# Altium project Aux_Lights_Daughter_REV3.PrjPcb
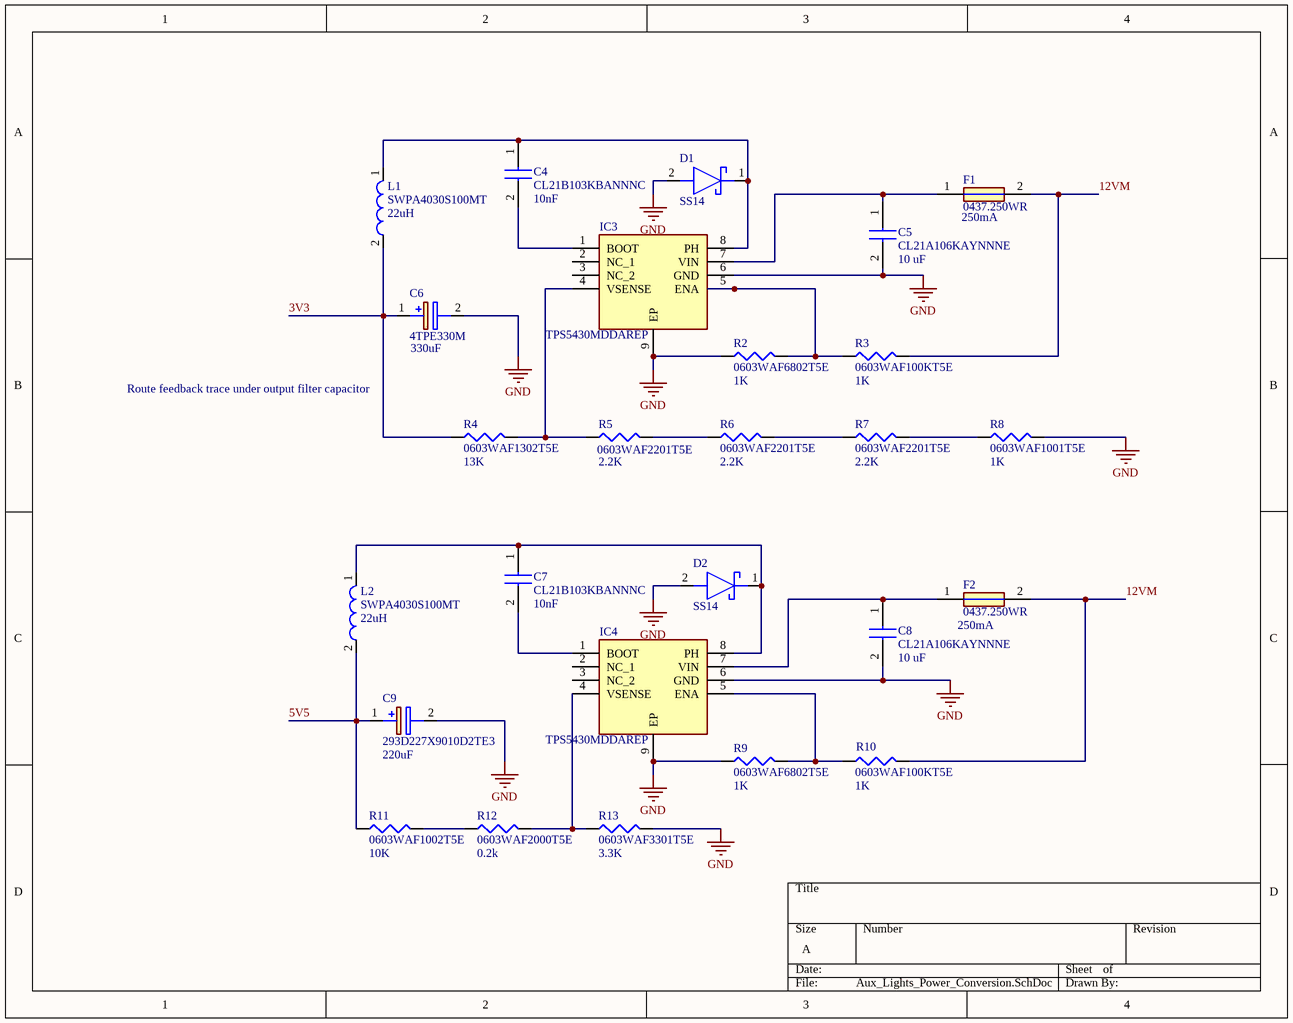
[diagram p0: Aux_Lights_Power_Conversion.SchDoc]
2 sheets, 49 parts. Net scope: global (net labels, ports and power ports of the same name join across sheets).
Board file: Aux_Lights_Daughter_REV3.PcbDoc
Sheets:
  Aux_Lights_Power_Conversion.SchDoc
  Aux_Lights_Daughter_REV3.SchDoc

## Sheet Aux_Lights_Power_Conversion.SchDoc
size A; SheetNumber: 1; SheetTotal: 2

### Parts
C4  CL21B103KBANNNC  value 10nF  [CAPC2012X65N]
C5  CL21A106KAYNNNE  value 10 uF  [CAPC2012X145N]
C6  4TPE330M  value 330uF  [POSCAP_D12_D15_D15E_D2E_D2_D3L_D4]
C7  CL21B103KBANNNC  value 10nF  [CAPC2012X65N]
C8  CL21A106KAYNNNE  value 10 uF  [CAPC2012X145N]
C9  293D227X9010D2TE3  value 220uF  [CAPPM7343X310N]
D1  SS14  [DIONM5327X242N]
D2  SS14  [DIONM5327X242N]
F1  0437.250WR  value 250mA  [FUSC3216X86N]
F2  0437.250WR  value 250mA  [FUSC3216X86N]
IC3  TPS5430MDDAREP  [SOIC127P600X170-9N]
IC4  TPS5430MDDAREP  [SOIC127P600X170-9N]
L1  SWPA4030S100MT  value 22uH  [SWPA4030S100MT]
L2  SWPA4030S100MT  value 22uH  [SWPA4030S100MT]
R2  0603WAF6802T5E  value 1K  [J1-0603]
R3  0603WAF100KT5E  value 1K  [J1-0603]
R4  0603WAF1302T5E  value 13K  [J1-0603]
R5  0603WAF2201T5E  value 2.2K  [J1-0603]
R6  0603WAF2201T5E  value 2.2K  [J1-0603]
R7  0603WAF2201T5E  value 2.2K  [J1-0603]
R8  0603WAF1001T5E  value 1K  [J1-0603]
R9  0603WAF6802T5E  value 1K  [J1-0603]
R10  0603WAF100KT5E  value 1K  [J1-0603]
R11  0603WAF1002T5E  value 10K  [J1-0603]
R12  0603WAF2000T5E  value 0.2k  [J1-0603]
R13  0603WAF3301T5E  value 3.3K  [J1-0603]

### Nets
GND: C5.2 C6.2(-) C8.2 C9.2(-) D1.2(A) D2.2(A) IC3.6(GND) IC3.9(EP) IC4.6(GND) IC4.9(EP) R2.1 R8.2 R9.1 R13.2
3V3: C6.1(+) L1.2 R4.1
5V5: C9.1(+) L2.2 R11.1
12VM: F1.2 F2.2 R3.2 R10.2
NetC4_1: C4.1 D1.1(K) IC3.8(PH) L1.1
NetC4_2: C4.2 IC3.1(BOOT)
NetC5_1: C5.1 F1.1 IC3.7(VIN)
NetC7_1: C7.1 D2.1(K) IC4.8(PH) L2.1
NetC7_2: C7.2 IC4.1(BOOT)
NetC8_1: C8.1 F2.1 IC4.7(VIN)
NetIC3_4: IC3.4(VSENSE) R4.2 R5.1
NetIC3_5: IC3.5(ENA) R2.2 R3.1
NetIC4_4: IC4.4(VSENSE) R12.2 R13.1
NetIC4_5: IC4.5(ENA) R9.2 R10.1
NetR5_2: R5.2 R6.1
NetR6_2: R6.2 R7.1
NetR7_2: R7.2 R8.1
NetR11_2: R11.2 R12.1

Not connected (* = marked no-connect by the designer): IC3 2(NC_1) 3(NC_2); IC4 2(NC_1) 3(NC_2)

### Notes on the sheet
- Route feedback trace under output filter capacitor

### Library data of the parts
C4 C7 = CL21B103KBANNNC: Capacitor; Manufacturer_Name: Samsung Electro-Mechanics; Datasheet Link: https://datasheet.datasheetarchive.com/originals/distributors/Datasheets_SAMA/97c54fb7f716f6f5bd35dfc2c9b17795.pdf; Height: 0.65mm; Manufacturer_Part_Number: CL21B103KBANNNC
C5 C8 = CL21A106KAYNNNE: Capacitor; Manufacturer_Name: Samsung Electro-Mechanics; Datasheet Link: https://datasheet.datasheetarchive.com/originals/distributors/Datasheets_SAMA/6a45835c9b7400e9b49c55c38a8ff4a2.pdf; Height: 1.45mm; Manufacturer_Part_Number: CL21A106KAYNNNE
C6 = 4TPE330M: Capacitor Polarised; Manufacturer_Name: Panasonic; Datasheet Link: http://industrial.panasonic.com/cdbs/www-data/pdf/AAA8000/AAA8000C36.pdf; Manufacturer_Part_Number: 4TPE330M
C9 = 293D227X9010D2TE3: Capacitor Polarised; Manufacturer_Name: Vishay; Datasheet Link: http://www.vishay.com/doc?40002; Height: 3.1mm; Manufacturer_Part_Number: 293D227X9010D2TE3
D1 D2 = SS14: Schottky Diode; Manufacturer_Name: MDD(Microdiode Electronics); Datasheet Link: https://datasheet.lcsc.com/szlcsc/1903051003_MDD-Jiangsu-Yutai-Elec-SS14_C2480.pdf; Height: 2.42mm; Manufacturer_Part_Number: SS14
F1 F2 = 0437.250WR: Fuse; Manufacturer_Name: LITTELFUSE; Datasheet Link: https://m.littelfuse.com/~/media/electronics/datasheets/fuses/littelfuse_fuse_437_datasheet.pdf.pdf; Height: 0.864mm; Manufacturer_Part_Number: 0437.250WR
IC3 IC4 = TPS5430MDDAREP: Integrated Circuit; Manufacturer_Name: Texas Instruments; Datasheet Link: http://www.ti.com/lit/gpn/tps5430-ep; Height: 1.7mm; Mouser2 Part Number: 595-TPS5430MDDAREP; Mouser2 Price/Stock: https://www.mouser.com/Search/Refine.aspx?Keyword=595-TPS5430MDDAREP; Manufacturer_Part_Number: TPS5430MDDAREP
R2-R13 = Res3: Resistor; Published: 8-Jun-2000; LatestRevisionDate: 29-May-2009; LatestRevisionNote: IPC-7351 Footprint Added.; PackageReference: J1-0603; Publisher: Altium Limited; PackageDescription: Chip Resistor

## Sheet Aux_Lights_Daughter_REV3.SchDoc
size A; SheetNumber: 2; SheetTotal: 2
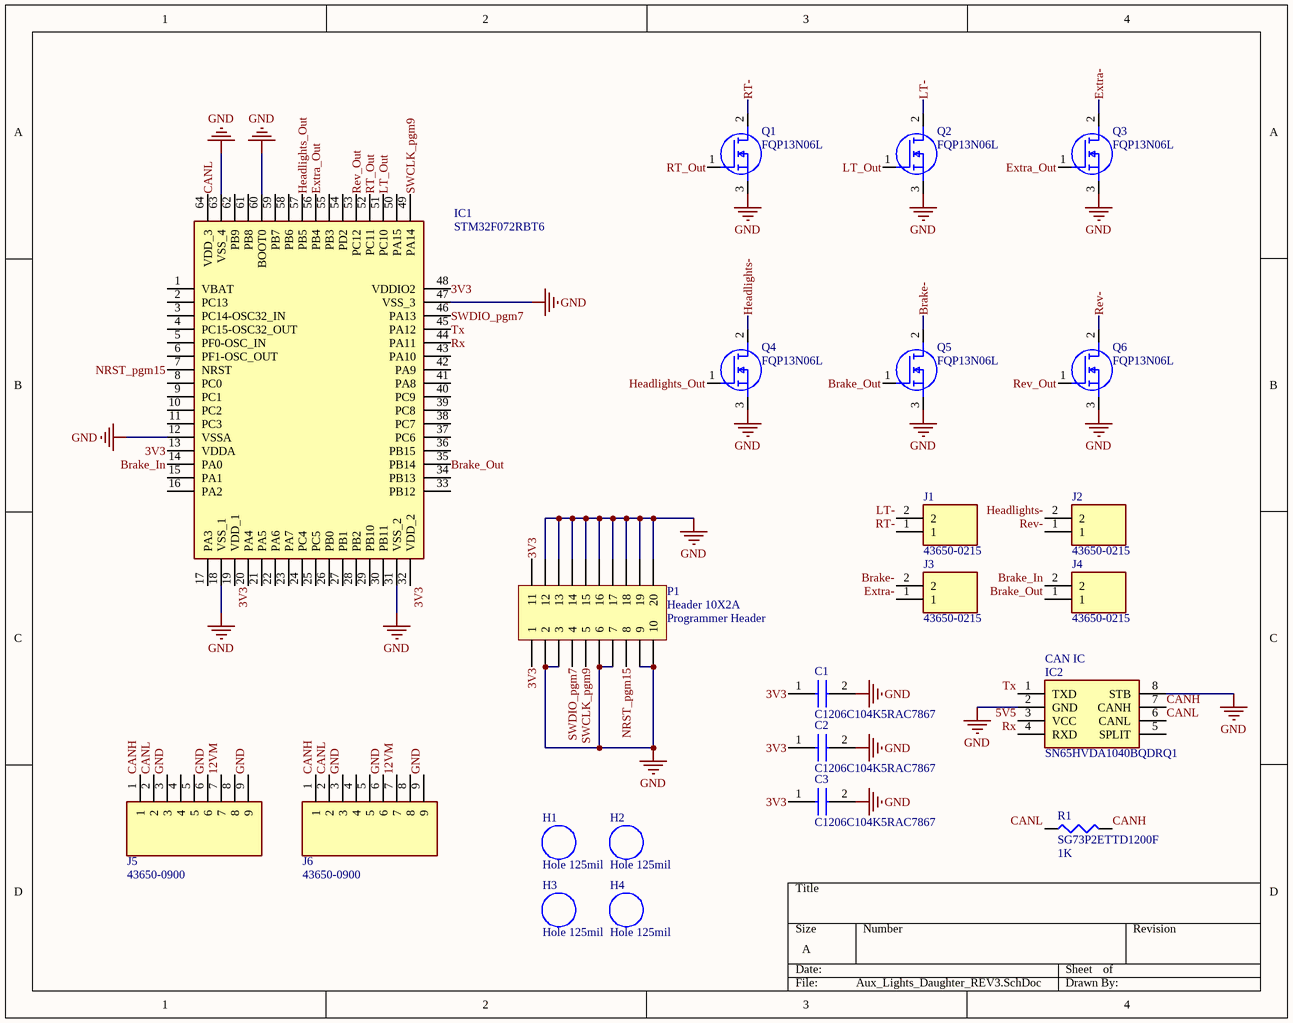
[diagram p1: Aux_Lights_Daughter_REV3.SchDoc]

### Parts
C1  C1206C104K5RAC7867  [CAPC3216X110N]
C2  C1206C104K5RAC7867  [CAPC3216X110N]
C3  C1206C104K5RAC7867  [CAPC3216X110N]
H1  Hole 125mil  [Hole]
H2  Hole 125mil  [Hole]
H3  Hole 125mil  [Hole]
H4  Hole 125mil  [Hole]
IC1  STM32F072RBT6  [QFP50P1200X1200X160-64N]
IC2  SN65HVDA1040BQDRQ1  [SOIC127P600X175-8N]
J1  43650-0215  [43650-02YY_15,16,17]
J2  43650-0215  [43650-02YY_15,16,17]
J3  43650-0215  [43650-02YY_15,16,17]
J4  43650-0215  [43650-02YY_15,16,17]
J5  43650-0900  [43650-09YY_R]
J6  43650-0900  [43650-09YY_R]
P1  Header 10X2A  [HDR2X10_CEN]
Q1  FQP13N06L  [TO254P483X1016X2261-3P]
Q2  FQP13N06L  [TO254P483X1016X2261-3P]
Q3  FQP13N06L  [TO254P483X1016X2261-3P]
Q4  FQP13N06L  [TO254P483X1016X2261-3P]
Q5  FQP13N06L  [TO254P483X1016X2261-3P]
Q6  FQP13N06L  [TO254P483X1016X2261-3P]
R1  SG73P2ETTD1200F  value 1K  [14-1210]

### Nets
GND: C1.2 C2.2 C3.2 IC1.12(VSSA) IC1.18(VSS_1) IC1.31(VSS_2) IC1.47(VSS_3) IC1.60(BOOT0) IC1.63(VSS_4) IC2.2(GND) IC2.8(STB) J5.3 J5.6 J5.9 J6.3 J6.6 J6.9 P1.2 P1.3 P1.6 P1.7 P1.9 P1.10 P1.12 P1.13 P1.14 P1.15 P1.16 P1.17 P1.18 P1.19 P1.20 Q1.3(S) Q2.3(S) Q3.3(S) Q4.3(S) Q5.3(S) Q6.3(S)
3V3: C1.1 C2.1 C3.1 IC1.13(VDDA) IC1.19(VDD_1) IC1.32(VDD_2) IC1.48(VDDIO2) P1.1 P1.11
5V5: IC2.3(VCC)
12VM: J5.7 J6.7
Brake-: J3.2 Q5.2(D)
Brake_In: IC1.14(PA0) J4.2
Brake_Out: IC1.35(PB14) J4.1 Q5.1(G)
CANH: IC2.7(CANH) J5.1 J6.1 R1.2
CANL: IC1.64(VDD_3) IC2.6(CANL) J5.2 J6.2 R1.1
Extra-: J3.1 Q3.2(D)
Extra_Out: IC1.56(PB4) Q3.1(G)
Headlights-: J2.2 Q4.2(D)
Headlights_Out: IC1.57(PB5) Q4.1(G)
LT-: J1.2 Q2.2(D)
LT_Out: IC1.51(PC10) Q2.1(G)
NRST_pgm15: IC1.7(NRST) P1.8
Rev-: J2.1 Q6.2(D)
Rev_Out: IC1.53(PC12) Q6.1(G)
RT-: J1.1 Q1.2(D)
RT_Out: IC1.52(PC11) Q1.1(G)
Rx: IC1.44(PA11) IC2.4(RXD)
SWCLK_pgm9: IC1.49(PA14) P1.5
SWDIO_pgm7: IC1.46(PA13) P1.4
Tx: IC1.45(PA12) IC2.1(TXD)

Not connected (* = marked no-connect by the designer): IC1 1(VBAT) 2(PC13) 3(PC14-OSC32_IN) 4(PC15-OSC32_OUT) 5(PF0-OSC_IN) 6(PF1-OSC_OUT) 8(PC0) 9(PC1) 10(PC2) 11(PC3) 15(PA1) 16(PA2) 17(PA3) 20(PA4) 21(PA5) 22(PA6) 23(PA7) 24(PC4) 25(PC5) 26(PB0) 27(PB1) 28(PB2) 29(PB10) 30(PB11) 33(PB12) 34(PB13) 36(PB15) 37(PC6) 38(PC7) 39(PC8) 40(PC9) 41(PA8) 42(PA9) 43(PA10) 50(PA15) 54(PD2) 55(PB3) 58(PB6) 59(PB7) 61(PB8) 62(PB9); IC2 5(SPLIT); J5 4 5 8; J6 4 5 8

### Notes on the sheet
- (near P1) Programmer Header
- (near IC2) CAN IC

### Library data of the parts
C1-C3 = C1206C104K5RAC7867: Capacitor; Manufacturer_Name: Kemet; Datasheet Link: https://componentsearchengine.com//C1206C104K5RAC7867.pdf; Height: 1.1mm; Mouser2 Part Number: 80-C1206104K5RAC7867; Mouser2 Price/Stock: https://www.mouser.com/Search/Refine.aspx?Keyword=80-C1206104K5RAC7867; Manufacturer_Part_Number: C1206C104K5RAC7867
IC1 = STM32F072RBT6: Integrated Circuit; Manufacturer_Name: STMicroelectronics; Datasheet Link: https://componentsearchengine.com//STM32F072RBT6.pdf; Height: 1.6mm; Mouser2 Part Number: 511-STM32F072RBT6; Mouser2 Price/Stock: https://www.mouser.com/Search/Refine.aspx?Keyword=511-STM32F072RBT6; Manufacturer_Part_Number: STM32F072RBT6
IC2 = SN65HVDA1040BQDRQ1: Integrated Circuit; Manufacturer_Name: Texas Instruments; Datasheet Link: http://www.ti.com/lit/gpn/SN65HVDA1040B-Q1; Height: 1.75mm; Manufacturer_Part_Number: SN65HVDA1040BQDRQ1
J1-J4 = 43650-0215: Connector; Manufacturer_Name: Molex; Datasheet Link: https://componentsearchengine.com//43650-0215.pdf; Height: 9.9mm; Mouser2 Part Number: 538-43650-0215; Mouser2 Price/Stock: https://www.mouser.com/Search/Refine.aspx?Keyword=538-43650-0215; Manufacturer_Part_Number: 43650-0215
J5 J6 = 43650-0900: Connector; Manufacturer_Name: Molex; Datasheet Link: https://www.molex.com/pdm_docs/sd/436500200_sd.pdf; Height: 5.57mm; Manufacturer_Part_Number: 43650-0900
P1 = Header 10X2A: Header, 10-Pin, Dual row; LatestRevisionDate: 17-Jul-2002; LatestRevisionNote: Re-released for DXP Platform.; Publisher: Altium Limited
Q1-Q6 = FQP13N06L: MOSFET (N-Channel); Manufacturer_Name: ON Semiconductor; Datasheet Link: https://componentsearchengine.com//FQP13N06L.pdf; Height: 4.83mm; Mouser2 Part Number: 512-FQP13N06L; Mouser2 Price/Stock: https://www.mouser.com/Search/Refine.aspx?Keyword=512-FQP13N06L; Manufacturer_Part_Number: FQP13N06L
R1 = Res3: Resistor; Published: 8-Jun-2000; LatestRevisionDate: 29-May-2009; LatestRevisionNote: IPC-7351 Footprint Added.; PackageReference: J1-0603; Publisher: Altium Limited; PackageDescription: Chip Resistor

## Nets that join several sheets
GND: Aux_Lights_Power_Conversion (14 pins), Aux_Lights_Daughter_REV3 (38 pins)
3V3: Aux_Lights_Power_Conversion (C6.1 L1.2 R4.1), Aux_Lights_Daughter_REV3 (9 pins)
5V5: Aux_Lights_Power_Conversion (C9.1 L2.2 R11.1), Aux_Lights_Daughter_REV3 (IC2.3)
12VM: Aux_Lights_Power_Conversion (F1.2 F2.2 R3.2 R10.2), Aux_Lights_Daughter_REV3 (J5.7 J6.7)